# Altium schematic sheet NewSpeedRadar_Board.SchDoc
size A2
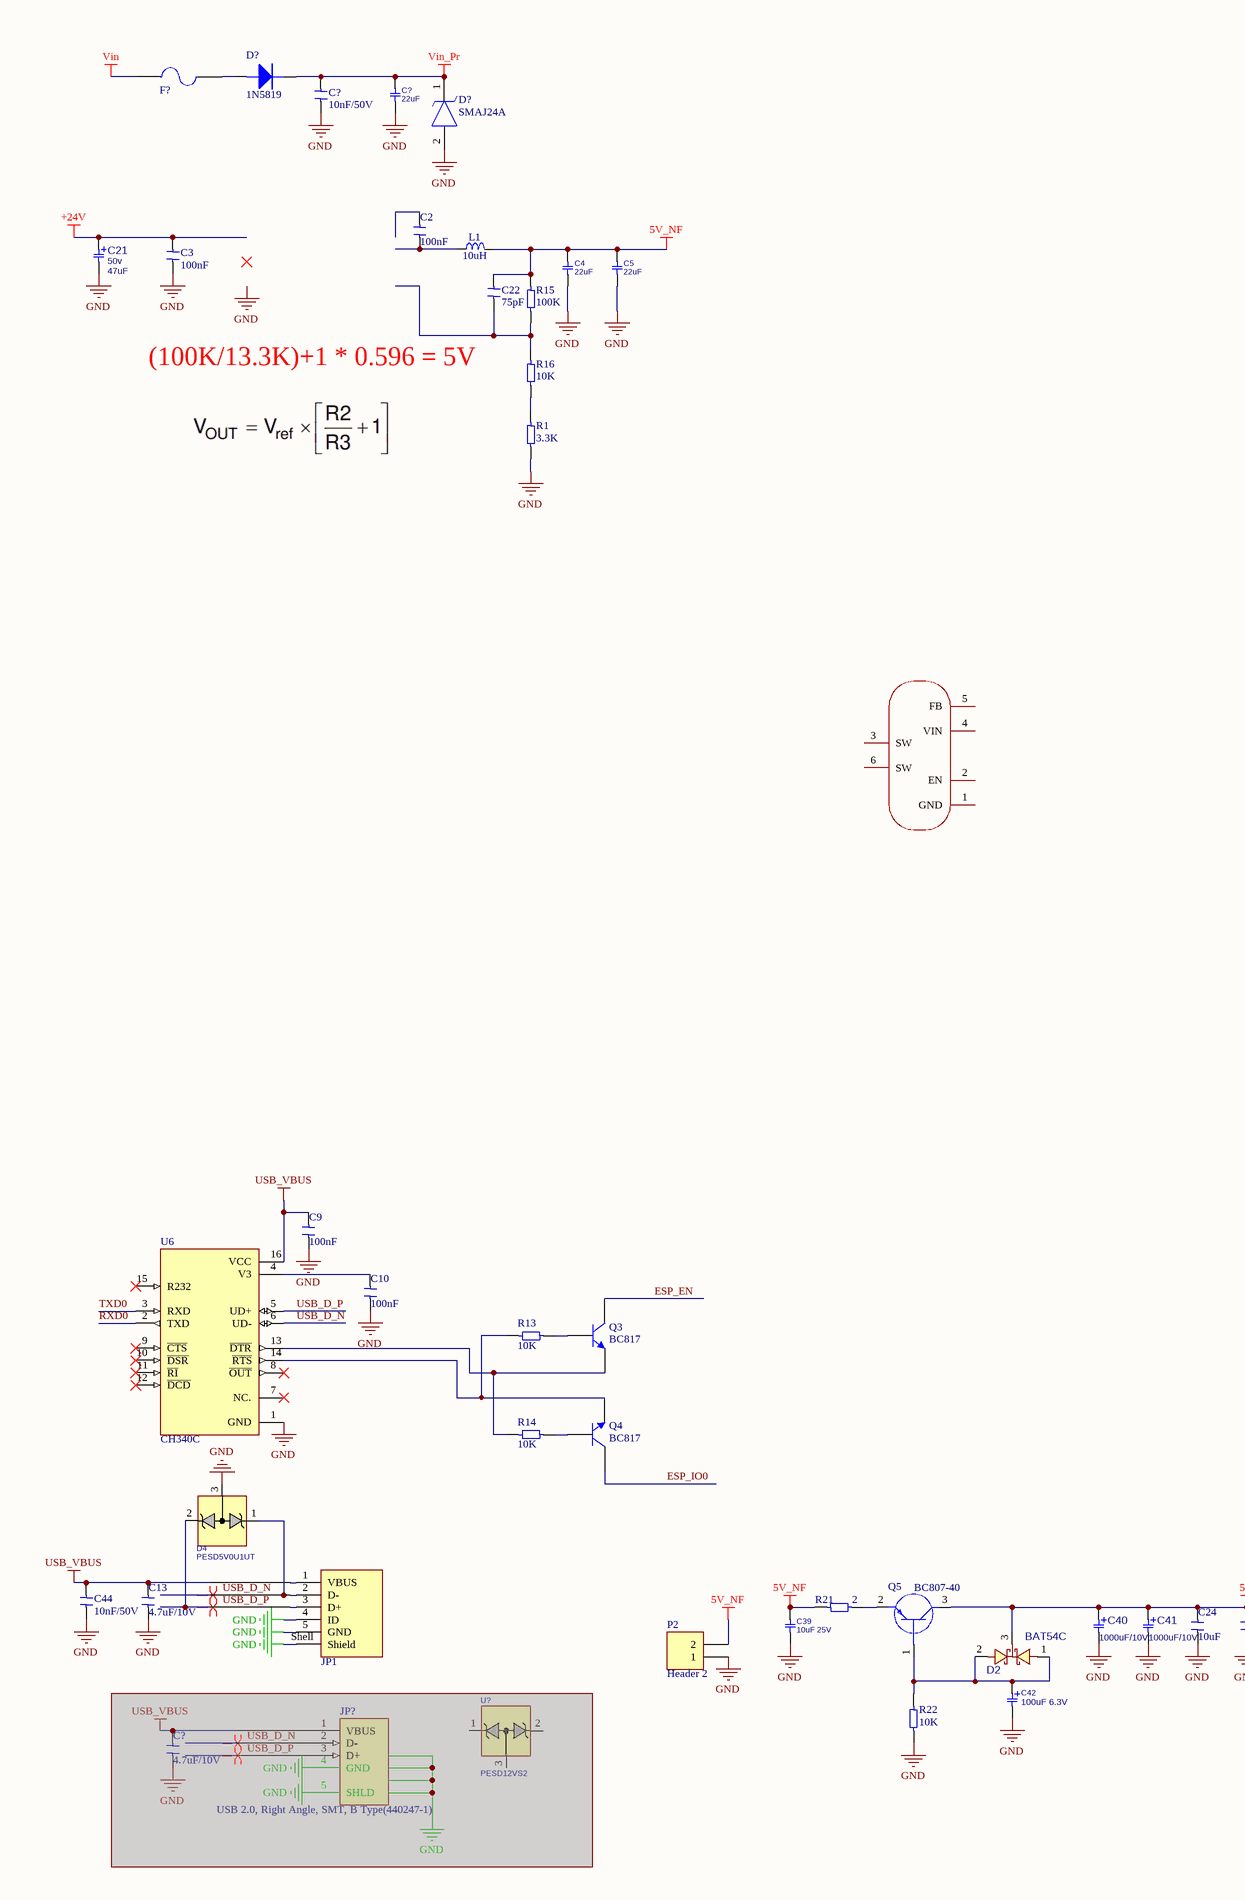
[diagram p0: NewSpeedRadar_Board.SchDoc, left]
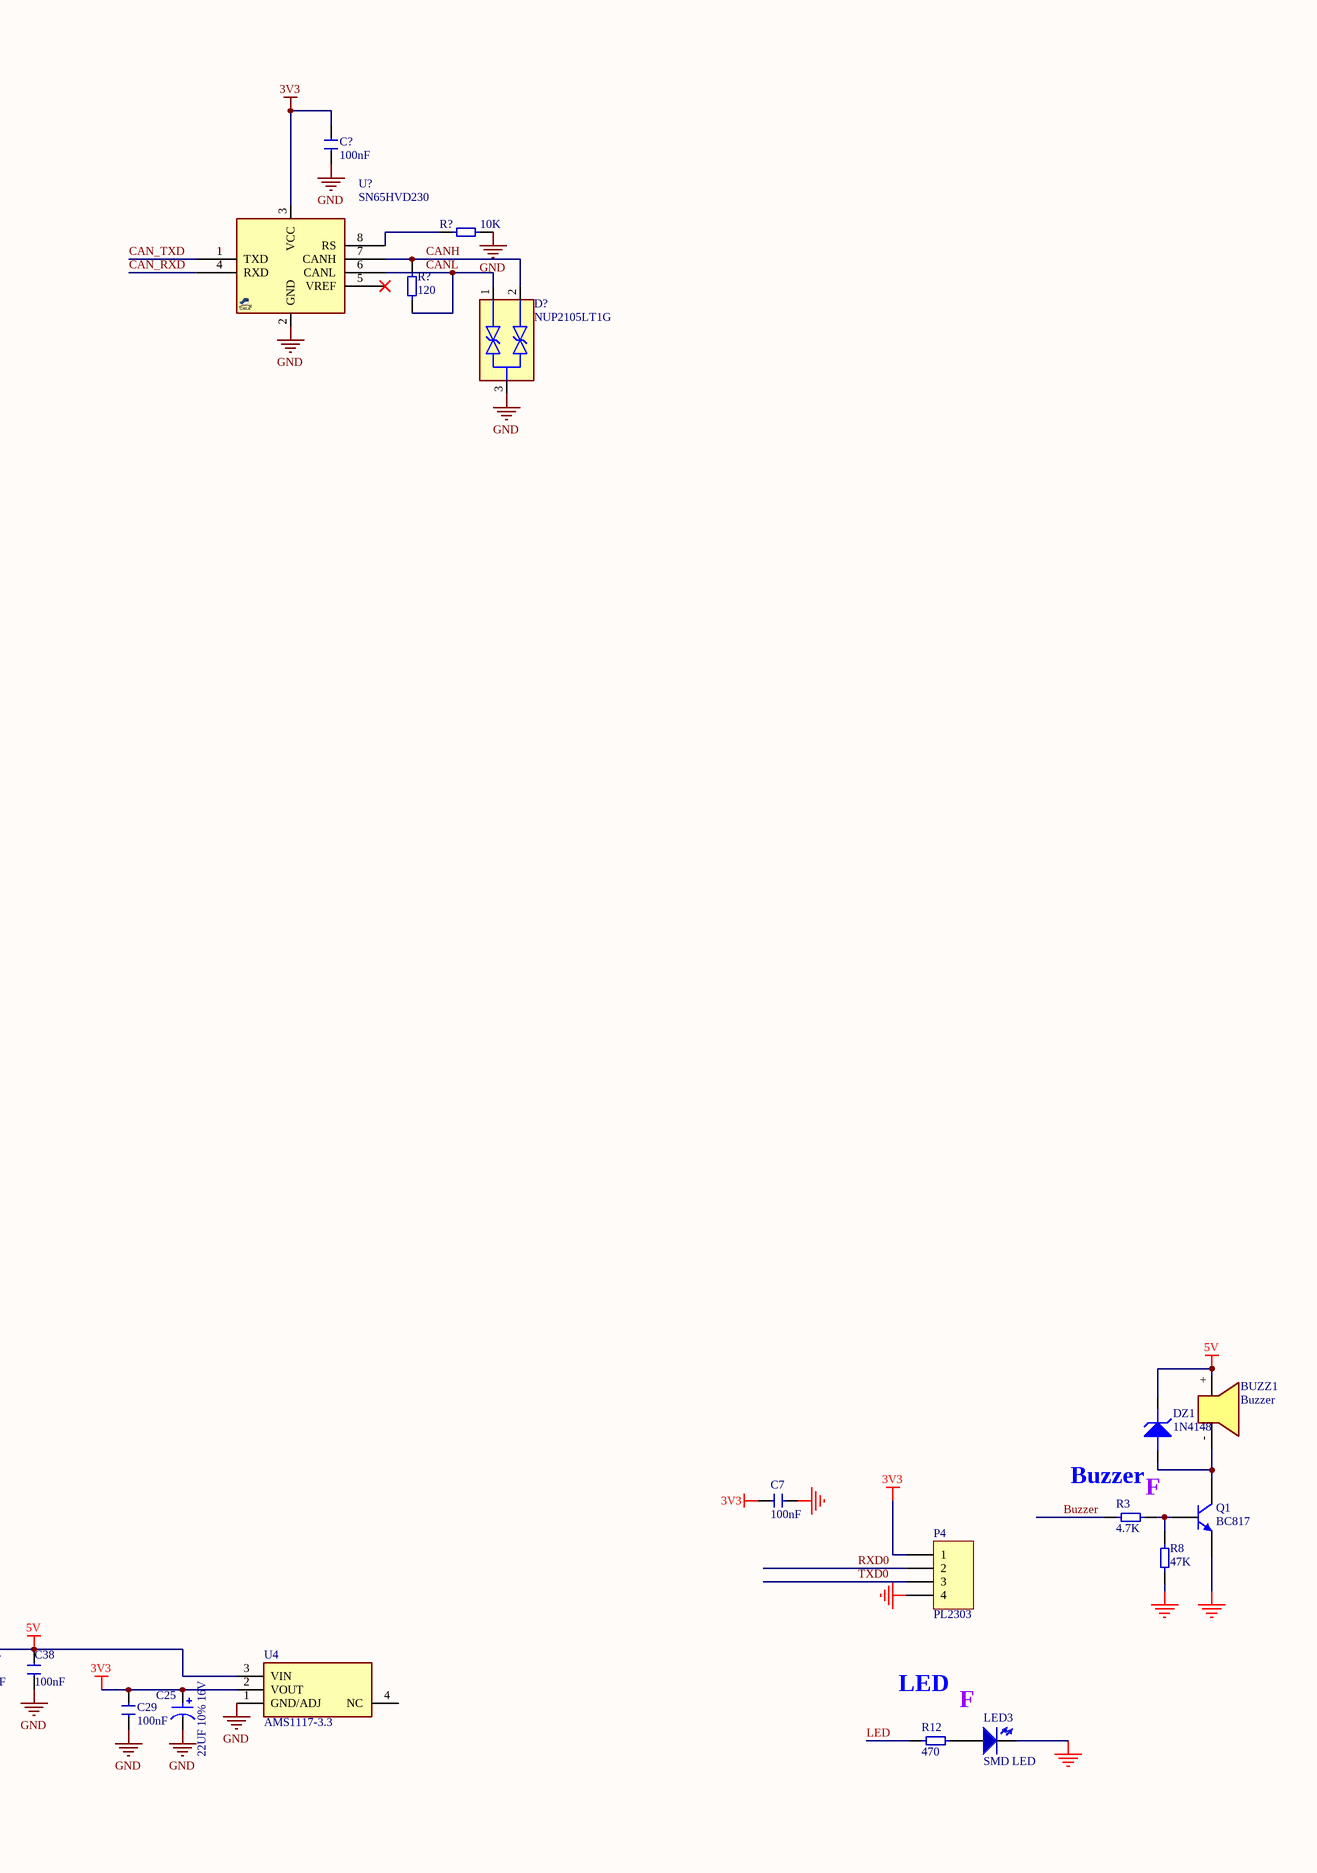
[diagram p1: NewSpeedRadar_Board.SchDoc, right]

## Parts
(Parts that share a designator on the sheet are numbered #1, #2 ... from top to bottom, then left to right.)
BUZZ1  Buzzer  [My_Buzzer]
C2  100nF  [0805 Capacitor]
C3  100nF  [0805 Capacitor]
C4  22uF  [C1206E]
C5  22uF  [C1206E]
C7  100nF  [0805 Capacitor]
C9  100nF  [0805 Capacitor]
C10  100nF  [0805 Capacitor]
C13  4.7uF/10V  [0805 Capacitor]
C21  PARAM2: 50v  [C_EL_6X12]  (hidden comment: 47uF)
C22  75pF  [0805 Capacitor]
C24  10uF  [0805 Capacitor]
C25  22UF 10% 16V  [Tantalum-B]
C29  100nF  [0805 Capacitor]
C38  100nF  [0805 Capacitor]
C39  10uF 25V  [C1206E]
C40  1000uF/10V  [C_EL_10X16]
C41  1000uF/10V  [C_EL_10X16]
C42  100uF 6.3V  [C_TN_3528]
C44  10nF/50V  [0805 Capacitor]
C?#1  10nF/50V  [C0603E]
C?#2  22uF  [C1206E]
C?#3  100nF  [C0603E]
C?#4  4.7uF/10V  [0805 Capacitor]  (masked out: inside a compile mask, not in the netlist)
D2  BAT54C  [SOT23_3]
D4  PESD5V0U1UT  [SOT323_3]
D?#1  1N5819  [$SMD-DO214AC]
D?#2  SMAJ24A  [DIOM5026X229N]
D?#3  NUP2105LT1G  [SOT95P237X111-3N]
DZ1  1N4148  [$SMD-Diode-mini MELF]
F?  F=1.0 A  [1206 FUSE]  (value not drawn)
JP1  651005136421  [651005136421]  (value not drawn)
JP?  USB 2.0, Right Angle, SMT, B Type(440247-1)  [440247]  (masked out: inside a compile mask, not in the netlist)
L1  10uH  [IND-SMD_L7.3-W6.6]
LED3  SMD LED  [LED_1206 RED]
P2  Header 2  [Header H2B-XHA]
P4  PL2303  [$Header4Female]
Q1  BC817  [SOT-23]
Q3  BC817  [SOT-23]
Q4  BC817  [SOT-23]
Q5  BC807-40  [SOT95P230X110-3N]
R1  3.3K  [0805 Resistor]
R3  4.7K  [0805 Resistor]
R8  47K  [0805 Resistor]
R12  470  [0805 Resistor]
R13  10K  [0805 Resistor]
R14  10K  [0805 Resistor]
R15  100K  [0805 Resistor]
R16  10K  [0805 Resistor]
R21  2  [0805 Resistor]
R22  10K  [0805 Resistor]
R?#1  10K  [R0603E]
R?#2  120  [R0603E]
U4  AMS1117-3.3  [SOT229P700X180-4N]
U6  CH340C  [SOIC127P600X180-16N]
U?#1  SN65HVD230  [SO_8]
U?#2  XL6019E1  [TO-263-5_L10.2-W9.9-P1.70-LS14.4-TL]  (value not drawn)
U?#3  PESD12VS2  [SOT323_3]  (masked out: inside a compile mask, not in the netlist)

## Nets
3V3: C7.2 C25.1 C29.2 C?#3.2 P4.1 U4.2(VOUT) U?#1.3(VCC)
5V: BUZZ1.+ C24.2 C38.2 C40.1 C41.1 D2.3 DZ1.K Q5.3(C) U4.3(VIN)
5V_NF: C4.2 C5.2 C22.2 C39.2 L1.2 P2.2 R15.1 R21.1
+24V: C3.2 C21.1
GND: C3.1 C4.1 C5.1 C7.1 C9.1 C10.1 C13.1 C21.2 C24.1 C25.2 C29.1 C38.1 C39.1 C40.2 C41.2 C42.2 C44.1 C?#1.1 C?#2.1 C?#3.1 D4.3(GND) D?#2.2(A) D?#3.3 JP1.4(ID) JP1.5(GND) JP1.Shell(Shield) LED3.2(K) P2.1 P4.4 Q1.2(E) R1.2 R8.1 R22.2 R?#1.2 U4.1(GND/ADJ) U6.1(GND) U?#1.2(GND)
USB_VBUS: C9.2 C13.2 C44.2 JP1.1(VBUS) U6.16(VCC)
Vin: F?.1
Vin_Pr: C?#1.2 C?#2.2 D?#1.K D?#2.1(K)
Buzzer: R3.1
CAN_RXD: U?#1.4(RXD)
CAN_TXD: U?#1.1(TXD)
CANH: D?#3.2 R?#2.2 U?#1.7(CANH)
CANL: D?#3.1 R?#2.1 U?#1.6(CANL)
ESP_EN: Q3.3(C)
ESP_IO0: Q4.3(C)
LED: R12.1
RXD0: P4.2 U6.2(TXD)
TXD0: P4.3 U6.3(RXD)
USB_D_N: D4.1(IO1) JP1.2(D-) U6.6(UD-)
USB_D_P: D4.2(IO2) JP1.3(D+) U6.5(UD+)
NetBUZZ1_-: BUZZ1.- DZ1.A Q1.3(C)
NetC2_2: C2.2 L1.1
NetC10_2: C10.2 U6.4(V3)
NetC22_1: C22.1 R15.2 R16.1
NetC42_1: C42.1 D2.1 D2.2 Q5.1(B) R22.1
NetD?#1_A: D?#1.A F?.2
NetLED3_1: LED3.1(A) R12.2
NetQ1_1: Q1.1(B) R3.2 R8.2
NetQ3_1: Q3.1(B) R13.1
NetQ3_2: Q3.2(E) R14.2 U6.13(~{DTR})
NetQ4_1: Q4.1(B) R14.1
NetQ4_2: Q4.2(E) R13.2 U6.14(~{RTS})
NetQ5_2: Q5.2(E) R21.2
NetR1_1: R1.1 R16.2
NetR?#1_1: R?#1.1 U?#1.8(RS)

Not connected (* = marked no-connect by the designer): C2 1; U4 4(NC); U6 7(NC.)* 8(~{OUT})* 9(~{CTS})* 10(~{DSR})* 11(~{RI})* 12(~{DCD})* 15(R232)*; U?#1 5(VREF)*; U?#2 1(GND) 2(EN) 3(SW) 4(VIN) 5(FB) 6(SW)

## Layout directives
differential pair: (no net found under the mark), USB_D_N, USB_D_P

## Notes on the sheet
- (near R16) (100K/13.3K)+1 * 0.596 = 5V
- Buzzer
- F
- LED
- Labels drawn without touching a wire or pin: GND

## Library data of the parts
BUZZ1 = Buzzer: 5-12v small buzzer (12mm)
C2 C3 C7 C9 C10 C13 C22 C24 C29 C38 C44 C?#1 C?#3 C?#4 = Capacitor SMD
  C2 C3 C7 C9 C10 C29 C38 C?#3: Value: 100nF
  C13 C?#4: Value: 4.7uF/10V
  C22: Value: 75pF
  C24: Value: 10uF
  C44 C?#1: Value: 10nF/50V
C4 C5 C39 C?#2 = CAP_SMD_MLCC_22u25V: CAP, MLCC, X5R 22uF 25V 20% 1206; PARAM: X5R, 20%; MANF_P#: TMK316BBJ226ML-T; MANF: Taiyo Yuden; DESC: CAP, MLCC, 22uF, 25V, X5R,  20%, 1206; PARAM2: 25V; PRICE: 0.572$
  C4 C5 C?#2: VALUE: 22uF
  C39: VALUE: 10uF 25V
C21 = CAP_THD_EL_47uF_50v: CAP, THD, ELEC,; MANF_P#: MANF_PART#; DESC: DESCRIPTION; DIST#: MOUSER; PARAM: 20%; PRICE: 10= -$; MANF: MANF; ASSEMBLY: ASSEMBLY; VALUE: 47uF
C25 = Cap Pol SMD: CAP TANT 22UF 10% 16V SMD; Manufacturer: AVX Corporation; Manufacturer Part Number: TAJB226K016RNJ; Manufacturer Size Code: B; Current Footprint: 1411 (3528 Metric), 1210; Board Qty: 1000; Type: Molded; ESR (Equivalent Series Resistance): 2.3 Ohm; Notification: Current market demand for these product types have resulted in fluctuating and extending lead times. Lead times may differ.; ITEM/NO: NULL; PCB Name: GS-101; Part Number: 22UF 10% 16V; HelpURL: D:\HNA\Datasheet Documents\TAJ.pdf; Supplier 1: Digi-Key; Supplier Part Number 1: 478-1682-2-ND; RoHS: RoHS Compliant; Category: Capacitors; Stock 1: 84000; Pricing 1: 2000=0.1344, 4000=0.126, 10000=0.1176, 14000=0.116 (USD); Packaging: Tape & Reel (TR); Part Status: Active; Tolerance: ±10%; Operating Temperature: -55°C ~ 125°C; Lifetime @ Temp.: -; Mounting Type: Surface Mount; Package / Case: 1411 (3528 Metric), 1210; Size / Dimension: 0.138" L x 0.110" W (3.50mm x 2.80mm); Height - Seated (Max): 0.083" (2.10mm); Lead Spacing: -; Features: General Purpose; Failure Rate: -; ComponentLink1URL: http://datasheets.avx.com/TAJ.pdf; ComponentLink1Description: http://datasheets.avx.com/TAJ.pdf; Pricing: NULL; Supplier: NULL; Supplier Part Number: NULL; Parameter 1: *
C40 C41 = CAP_THD_EL_1000uF_16v: CAP, THD, ELEC,; MANF_P#: MANF_PART#; DESC: DESCRIPTION; DIST#: MOUSER; PARAM: 20%; PARAM2: 16v; PRICE: 10= -$; MANF: MANF; ASSEMBLY: ASSEMBLY; VALUE: 1000uF/10V
C42 = CAP_SMD_TAN_3528: CAP, SMD, TAN,; PARAM2: -V; VALUE: 100uF 6.3V
D2 = DIODE_SMD_SCHOTTKY_BAT54C: DIODE, SCHOTTKY, DUAL, 30V, 0.2A; MANF: Diodes; MANF_P#: BAT54C-7-F; DESC: DESCRIPTION; PARAM: 30V/200MW; ASSEMBLY: ASSEMBLY; PRICE: PRICE; PARAM2: 0.2A; VALUE: BAT54C
D4 U?#3 = TVS_X2_PESD12VS2: TVS, ESD PROTECT, 2CH, 15VBR, 0.2W; MANF_P#: PESD12VS2UQ,115; MANF: Nexperia; PARAM: 15VBR, -65~105oC; PRICE: 0.5$
  D4: VALUE: PESD5V0U1UT
  U?#3: VALUE: PESD12VS2
D?#1 = Diode$
D?#2 = SMAJ24A: TVS Diode (Uni-directional); Manufacturer_Name: LITTELFUSE; Datasheet Link: https://componentsearchengine.com/Datasheets/2/SMAJ24A.pdf; Height: 2.29mm; Manufacturer_Part_Number: SMAJ24A; Mouser Part Number: 576-SMAJ24A; Mouser Price/Stock: https://www.mouser.co.uk/ProductDetail/Littelfuse/SMAJ24A?qs=HR2RnyOI4E78ZevQKM2hdA%3D%3D; Arrow Part Number: SMAJ24A; Arrow Price/Stock: https://www.arrow.com/en/products/smaj24a/littelfuse?region=nac
D?#3 = NUP2105LT1G: Dual Bi-Directional TVS Diode 350W 3-Pin SOT-23 | ON Semiconductor NUP2105LT1G; SnapEDA_Link: https://www.snapeda.com/parts/NUP2105LT1G/Onsemi/view-part/?ref=snap; Package: SOT-23-3 ON Semiconductor; Value: *; MF: ON Semiconductor; MP: NUP2105LT1G; Check_prices: https://www.snapeda.com/parts/NUP2105LT1G/Onsemi/view-part/?ref=eda
DZ1 = Diode Zener$
F? = Fuse SMD1206: SMD Fuses 1206; Designer: Abbas Basereh; Desc.: SMD Fuses 1206; Data: 16-12-2016
JP1 = 651005136421: WR-COM Mini USB 2.0 Type B Vertical 5 Contacts; Manufacturer: Wurth Elektronik; Match Code: WR-USB; Gender: Receptacle; Interface Type: Type B; Number of Ports: 1; Rated Current: 1A; Working Voltage: 30V (AC); Manufacturer Part Number: 651005136421; Category: Input/Output Connectors; ComponentLink1Description: Website Link; ComponentLink1URL: https://www.we-online.com/redexpert/article/651005136421?ad; ComponentLink2Description: Datasheet Link; ComponentLink2URL: https://www.we-online.com/redexpert/spec/651005136421?ad; Mount: Through Hole; Operating Temperature Max: 105°C; Operating Temperature Min: -40°C; Packaging: Tray; Application: Mini USB 2.0; Number of Pins: 5; Orientation: Vertical
JP? = 440247-1: USB 2.0, Right Angle, SMT, B Type, Receptacle, 5 Position, Black; ContactMaterial: Copper Alloy; ContactPlating: Gold (30); PCB_Layout: Complies with manufacturer's recommendation.; DrillSize: Corresponds to nominal value.; PanelGround: Without; Current Footprint: SMD (Surface Mount, Right Angle); Assembly Status: A; Published: 15-Jul-2004; DatasheetDocument: 27-Jun-2003; PackageDocument: 27-Jun-2003; PackageReference: 440247; Publisher: Altium Limited; HousingMaterial: Thermoplastic; ComponentLink1Description: Manufacturer Link; ComponentLink1URL: http://www.tycoelectronics.com/; ComponentLink2Description: Packaging Specification; ComponentLink2URL: http://ecommas.tycoelectronics.com/commerce/DocumentDelivery/DDEController?Action=showdoc&DocId=Customer+Drawing%7F440247%7FD%7Fpdf%7FEnglish%7FC_440247_D.pdf; Manufacturer: *; Price: 0.082$
L1 = IND1008_1UH_20%_WURTH_74479787210B: Inductor; Part Description: Power Multilayer Inductor (WE-PMI Series); Manufacturer: WURTH ELEKTRONIK; Power: 1.95A; Resistance: 0.06R; Tolerance: ±20%; Part Number: IND1008_1UH_20%_WURTH_74479787210B; Component Kind: Standard; Component Type: Standard; Footprint: INDC2620X100N; Pin Count: 2; Value: 10uH; Manufacturer Part Number: 74479787210B; Case: 1008; Mounted: Yes; Socket: No; SMD: Yes; Sense: No; ComponentHeight: 1mm; HelpURL: \\cern.ch\dfs\Applications\Altium\Datasheets\IND_WURTH_WE-PMI_74479787210B.pdf; Author: CERN DEM JLC; CreateDate: 10/1/2014; LatestRevisionDate: 10/1/2014
LED3 = LED SMD
P2 = Header 2: Header, 2-Pin; LatestRevisionDate: 17-Jul-2002; LatestRevisionNote: Re-released for DXP Platform.; Publisher: Altium Limited
P4 = Header 4: Header, 4-Pin; LatestRevisionDate: 17-Jul-2002; LatestRevisionNote: Re-released for DXP Platform.; Publisher: Altium Limited
Q5 = BC807-40,215: Transistor BJT PNP; Manufacturer_Name: Nexperia; Datasheet Link: https://assets.nexperia.com/documents/data-sheet/BC807_SER.pdf; Height: 1.1mm; Manufacturer_Part_Number: BC807-40,215; Mouser Part Number: 771-BC807-40-T/R; Mouser Price/Stock: https://www.mouser.co.uk/ProductDetail/Nexperia/BC807-40215?qs=me8TqzrmIYUR795aoYEBCw%3D%3D; Arrow Part Number: BC807-40,215; Arrow Price/Stock: https://www.arrow.com/en/products/bc807-40215/nexperia?region=europe
R1 R3 R8 R12-R16 R21 R22 R?#1 R?#2 = Resistor SMD
  R1: Value: 3.3K
  R3: Value: 4.7K
  R8: Value: 47K
  R12: Value: 470
  R13 R14 R16 R22 R?#1: Value: 10K
  R15: Value: 100K
  R21: Value: 2
  R?#2: Value: 120
U4 = AMS1117-3.3: Integrated Circuit; Manufacturer_Name: Advanced; Datasheet Link: https://datasheet.datasheetarchive.com/originals/distributors/Datasheets-28/DSA-550594.pdf; Height: 1.8mm; Manufacturer_Part_Number: AMS1117-3.3
U6 = CH340C: USB to serial chip CH340; MF: WCH; Price: None; Availability: Not in stock; MP: CH340C; Package: None; SnapEDA_Link: https://www.snapeda.com/parts/CH340C/WCH/view-part/?ref=snap; Check_prices: https://www.snapeda.com/parts/CH340C/WCH/view-part/?ref=eda; Value: *
U?#1 = SN65HVD230_SOP8: CAN,  Transceivers, 3.3V (VDD); MANF: Texas Instruments; MANF_P#: SN65HVD230D, SN65HVD230QD; PARAM: -40~85oC; PRICE: 2.3$@MOUSER; PARAM2: 3.3V (VDD); VALUE: SN65HVD230
U?#2 = XL6019E1: Manufacturer: XLSEMI(芯龙); Add into BOM: yes; Function: Boost type; Output Type: Adjustable; Input Voltage: 5V~40V; Output Current: 5A; Switching Frequency: 180kHz; Number of Outputs: 1; Topology: Inversion type; Quiescent Current (Iq): 2.5mA; Switch tube (built-in/external): Built-in; Symbol: XL6019E1; Device: XL6019E1; LCSC Part Name: 180KHz 60V 5A开关电流升压/升降压型DC-DC转换器; Supplier Part: C73018; Manufacturer Part: XL6019E1; Supplier Footprint: TO-263-5; JLCPCB Part Class: Extended Part; Datasheet: https://atta.szlcsc.com/upload/public/pdf/source/20230915/0F37A40A07D65557F92F701F29EBE038.pdf; Supplier: LCSC; Convert to PCB: yes; Output Voltage: -; Operating Temperature: -40℃~+125℃; Synchronous Rectification: Yes